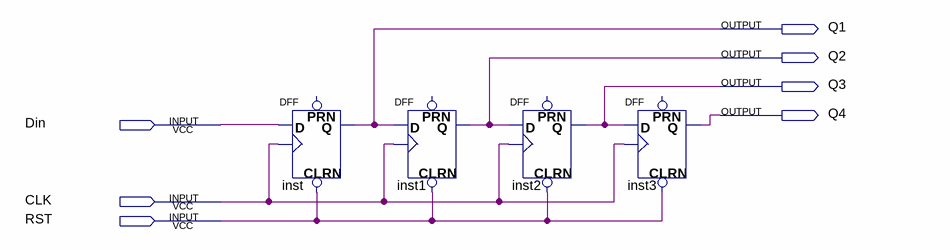
[diagram p0: schematic sheet]
// Quartus schematic FourBitShiftRegister.bdf as structural Verilog: 4 symbols, 7 pins
module FourBitShiftRegister (
  input  Din,
  input  CLK,
  input  RST,
  output Q1,
  output Q2,
  output Q3,
  output Q4
);

  DFF inst (.CLRN(RST), .CLK(CLK), .D(Din), .Q(Q1));  // open: PRN
  DFF inst1 (.CLRN(RST), .CLK(CLK), .D(Q1), .Q(Q2));  // open: PRN
  DFF inst2 (.CLRN(RST), .CLK(CLK), .D(Q2), .Q(Q3));  // open: PRN
  DFF inst3 (.CLRN(RST), .CLK(CLK), .D(Q3), .Q(Q4));  // open: PRN
endmodule
